# EAGLE design GPIO Split Protector with Console (EAGLE 7.4.0)
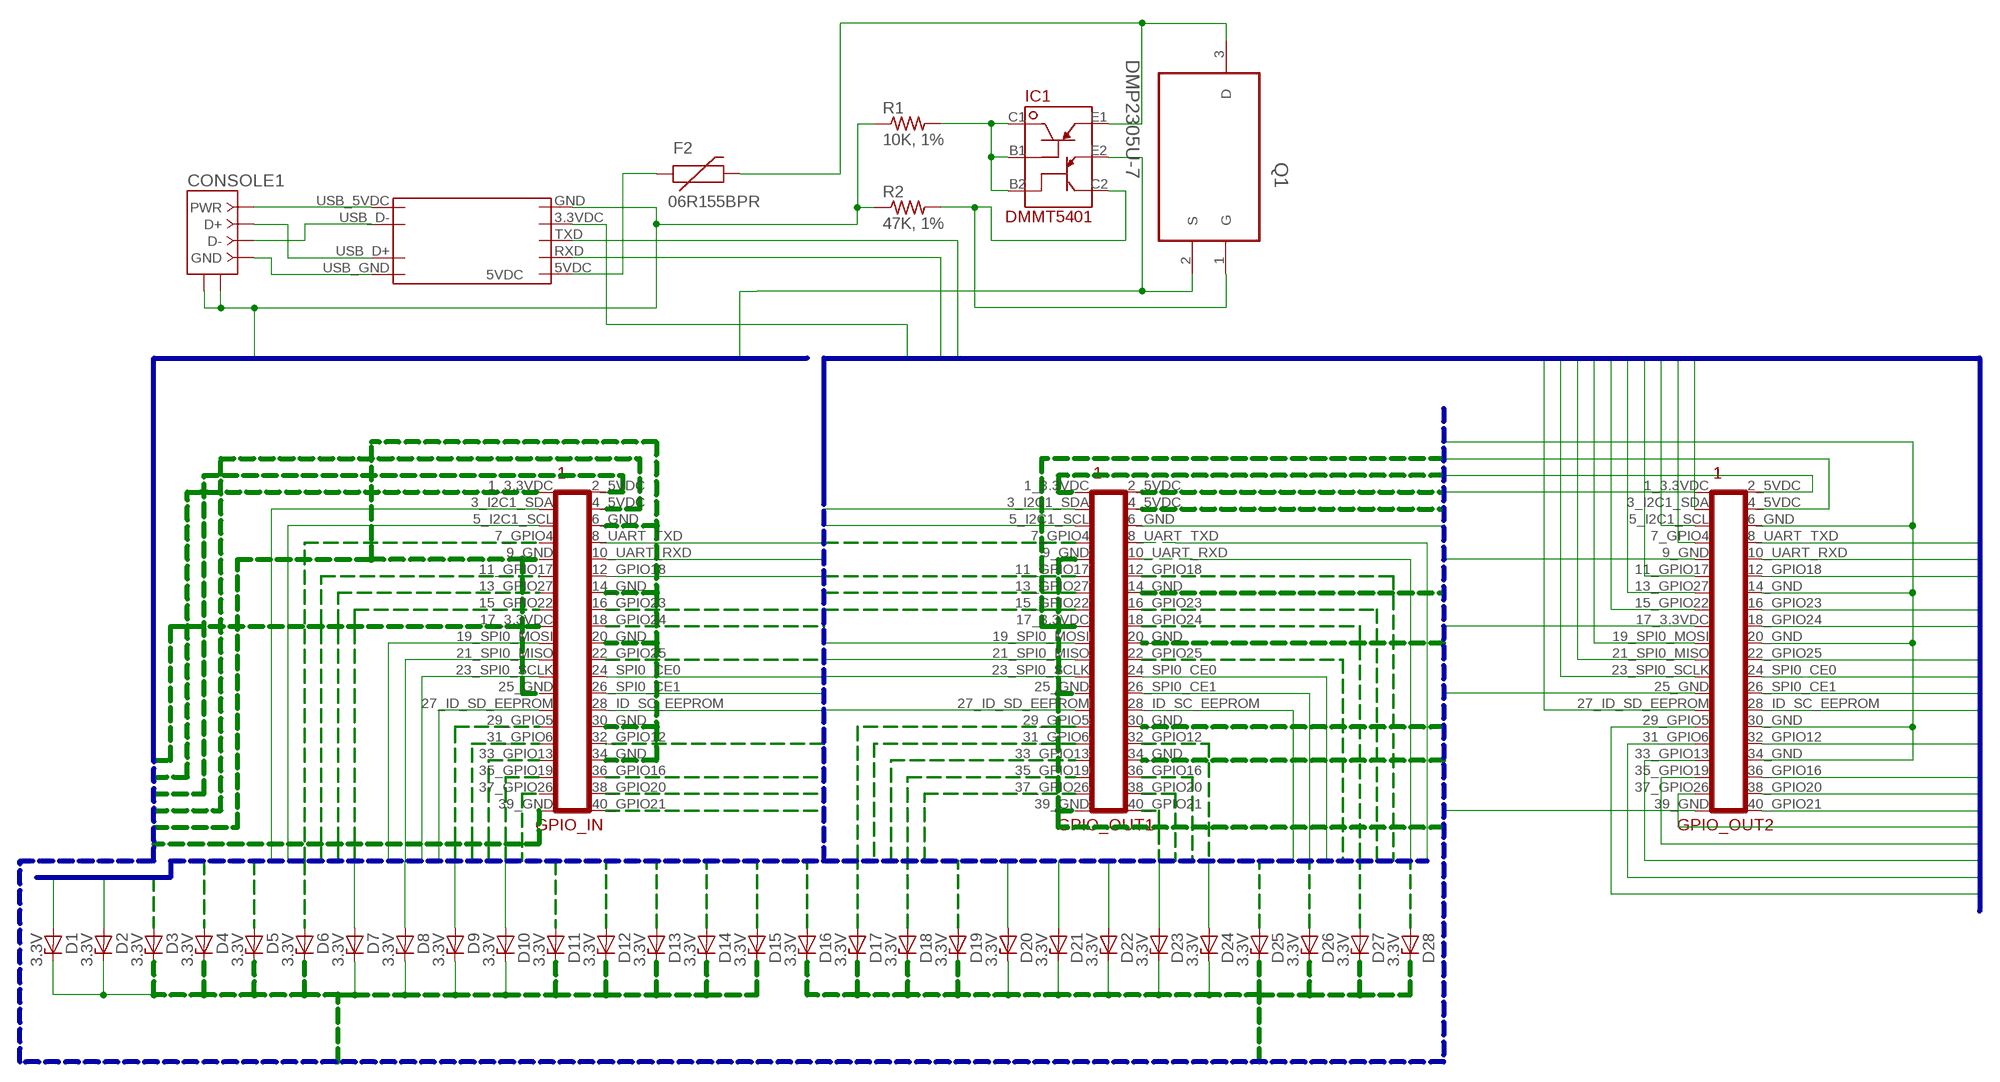
[diagram p0: schematic, sheet 1]

## Parts
CONSOLE1  USB-RA  [USBBF-1]
D1  3.3V  ZENER-DIODEDO41Z10  [DO41Z10]
D2  3.3V  ZENER-DIODEDO41Z10  [DO41Z10]
D3  3.3V  ZENER-DIODEDO41Z10  [DO41Z10]
D4  3.3V  ZENER-DIODEDO41Z10  [DO41Z10]
D5  3.3V  ZENER-DIODEDO41Z10  [DO41Z10]
D6  3.3V  ZENER-DIODEDO41Z10  [DO41Z10]
D7  3.3V  ZENER-DIODEDO41Z10  [DO41Z10]
D8  3.3V  ZENER-DIODEDO41Z10  [DO41Z10]
D9  3.3V  ZENER-DIODEDO41Z10  [DO41Z10]
D10  3.3V  ZENER-DIODEDO41Z10  [DO41Z10]
D11  3.3V  ZENER-DIODEDO41Z10  [DO41Z10]
D12  3.3V  ZENER-DIODEDO41Z10  [DO41Z10]
D13  3.3V  ZENER-DIODEDO41Z10  [DO41Z10]
D14  3.3V  ZENER-DIODEDO41Z10  [DO41Z10]
D15  3.3V  ZENER-DIODEDO41Z10  [DO41Z10]
D16  3.3V  ZENER-DIODEDO41Z10  [DO41Z10]
D17  3.3V  ZENER-DIODEDO41Z10  [DO41Z10]
D18  3.3V  ZENER-DIODEDO41Z10  [DO41Z10]
D19  3.3V  ZENER-DIODEDO41Z10  [DO41Z10]
D20  3.3V  ZENER-DIODEDO41Z10  [DO41Z10]
D21  3.3V  ZENER-DIODEDO41Z10  [DO41Z10]
D22  3.3V  ZENER-DIODEDO41Z10  [DO41Z10]
D23  3.3V  ZENER-DIODEDO41Z10  [DO41Z10]
D24  3.3V  ZENER-DIODEDO41Z10  [DO41Z10]
D25  3.3V  ZENER-DIODEDO41Z10  [DO41Z10]
D26  3.3V  ZENER-DIODEDO41Z10  [DO41Z10]
D27  3.3V  ZENER-DIODEDO41Z10  [DO41Z10]
D28  3.3V  ZENER-DIODEDO41Z10  [DO41Z10]
F2  06R155BPR  PTCPTH  [PTC]
GPIO_IN  RPI_GPIOUPPER  [RPI_GPIO_MALE]
GPIO_OUT1  RPI_GPIOUPPER  [RPI_GPIO_MALE]
GPIO_OUT2  RPI_GPIOUPPER  [RPI_GPIO_MALE]
IC1  DMMT5401  DMMT5401DMMT  [DMMT5401]
Q1  DMP2305U-7  [SOT103P240X110-3N]
R1  10K, 1%  R-US_0204/7  [0204/7]
R2  47K, 1%  R-US_0204/7  [0204/7]
UART1  GS27159  [GS27159]

## Nets
3.3VDC1: GPIO_IN.1_3.3VDC GPIO_OUT1.1_3.3VDC GPIO_OUT2.1_3.3VDC
3.3VDC2: GPIO_IN.17_3.3VDC GPIO_OUT1.17_3.3VDC GPIO_OUT2.17_3.3VDC
5VDC1: GPIO_IN.2_5VDC GPIO_OUT1.2_5VDC GPIO_OUT2.2_5VDC
5VDC2: GPIO_IN.4_5VDC GPIO_OUT1.4_5VDC GPIO_OUT2.4_5VDC IC1.E2 Q1.2(S)
5VDC_TO_FUSE: F2.P$1 UART1.5VDC
GND: CONSOLE1.CASE1(SHIELD1) CONSOLE1.CASE2(SHIELD2) D1.C D2.C D3.C D4.C D5.C D6.C D7.C D8.C D9.C D10.C D11.C D12.C D13.C D14.C D15.C D16.C D17.C D18.C D19.C D20.C D21.C D22.C D23.C D24.C D25.C D26.C D27.C D28.C GPIO_IN.6_GND GPIO_IN.9_GND GPIO_IN.14_GND GPIO_IN.20_GND GPIO_IN.25_GND GPIO_IN.30_GND GPIO_IN.34_GND GPIO_IN.39_GND GPIO_OUT1.6_GND GPIO_OUT1.9_GND GPIO_OUT1.14_GND GPIO_OUT1.20_GND GPIO_OUT1.25_GND GPIO_OUT1.30_GND GPIO_OUT1.34_GND GPIO_OUT1.39_GND GPIO_OUT2.6_GND GPIO_OUT2.9_GND GPIO_OUT2.14_GND GPIO_OUT2.20_GND GPIO_OUT2.25_GND GPIO_OUT2.30_GND GPIO_OUT2.34_GND GPIO_OUT2.39_GND R1.1 R2.1 UART1.GND
GPIO4: D3.A GPIO_IN.7_GPIO4 GPIO_OUT1.7_GPIO4 GPIO_OUT2.7_GPIO4
GPIO5: D11.A GPIO_IN.29_GPIO5 GPIO_OUT1.29_GPIO5 GPIO_OUT2.29_GPIO5
GPIO6: D12.A GPIO_IN.31_GPIO6 GPIO_OUT1.31_GPIO6 GPIO_OUT2.31_GPIO6
GPIO12: D25.A GPIO_IN.32_GPIO12 GPIO_OUT1.32_GPIO12 GPIO_OUT2.32_GPIO12
GPIO13: D13.A GPIO_IN.33_GPIO13 GPIO_OUT1.33_GPIO13 GPIO_OUT2.33_GPIO13
GPIO16: D26.A GPIO_IN.36_GPIO16 GPIO_OUT1.36_GPIO16 GPIO_OUT2.36_GPIO16 UART1.3.3VDC
GPIO17: D4.A GPIO_IN.11_GPIO17 GPIO_OUT1.11_GPIO17 GPIO_OUT2.11_GPIO17
GPIO18: D16.A GPIO_IN.12_GPIO18 GPIO_OUT1.12_GPIO18 GPIO_OUT2.12_GPIO18
GPIO19: D14.A GPIO_IN.35_GPIO19 GPIO_OUT1.35_GPIO19 GPIO_OUT2.35_GPIO19
GPIO20: D27.A GPIO_IN.38_GPIO20 GPIO_OUT1.38_GPIO20 GPIO_OUT2.38_GPIO20
GPIO21: D28.A GPIO_IN.40_GPIO21 GPIO_OUT1.40_GPIO21 GPIO_OUT2.40_GPIO21
GPIO22: D6.A GPIO_IN.15_GPIO22 GPIO_OUT1.15_GPIO22 GPIO_OUT2.15_GPIO22
GPIO23: D17.A GPIO_IN.16_GPIO23 GPIO_OUT1.16_GPIO23 GPIO_OUT2.16_GPIO23
GPIO24: D18.A GPIO_IN.18_GPIO24 GPIO_OUT1.18_GPIO24 GPIO_OUT2.18_GPIO24
GPIO25: D19.A GPIO_IN.22_GPIO25 GPIO_OUT1.22_GPIO25 GPIO_OUT2.22_GPIO25
GPIO26: D15.A GPIO_IN.37_GPIO26 GPIO_OUT1.37_GPIO26 GPIO_OUT2.37_GPIO26
GPIO27: D5.A GPIO_IN.13_GPIO27 GPIO_OUT1.13_GPIO27 GPIO_OUT2.13_GPIO27
I2C_SCL: D2.A GPIO_IN.5_I2C1_SCL GPIO_OUT1.5_I2C1_SCL GPIO_OUT2.5_I2C1_SCL
I2C_SDA: D1.A GPIO_IN.3_I2C1_SDA GPIO_OUT1.3_I2C1_SDA GPIO_OUT2.3_I2C1_SDA
ID_SC: D24.A GPIO_IN.28_ID_SC_EEPROM GPIO_OUT1.28_ID_SC_EEPROM GPIO_OUT2.28_ID_SC_EEPROM
ID_SD: D10.A GPIO_IN.27_ID_SD_EEPROM(27_ID_SC_EEPROM) GPIO_OUT1.27_ID_SD_EEPROM(27_ID_SC_EEPROM) GPIO_OUT2.27_ID_SD_EEPROM(27_ID_SC_EEPROM)
IN: F2.P$2 IC1.E1 Q1.3(D)
N$2: IC1.B1 IC1.B2 IC1.C1 R1.2
N$3: IC1.C2 Q1.1(G) R2.2
N$14: CONSOLE1.4(GND) UART1.USB_GND
N$15: CONSOLE1.1(PWR) UART1.USB_5VDC
N$16: CONSOLE1.2(D-) UART1.USB_D-
N$17: CONSOLE1.3(D+) UART1.USB_D+
SPI_CE0: D22.A GPIO_IN.24_SPI0_CE0 GPIO_OUT1.24_SPI0_CE0 GPIO_OUT2.24_SPI0_CE0
SPI_CE1: D23.A GPIO_IN.26_SPI0_CE1 GPIO_OUT1.26_SPI0_CE1 GPIO_OUT2.26_SPI0_CE1
SPI_MISO: D8.A GPIO_IN.21_SPI0_MISO GPIO_OUT1.21_SPI0_MISO GPIO_OUT2.21_SPI0_MISO
SPI_MOSI: D7.A GPIO_IN.19_SPI0_MOSI GPIO_OUT1.19_SPI0_MOSI GPIO_OUT2.19_SPI0_MOSI
SPI_SCLK: D9.A GPIO_IN.23_SPI0_SCLK GPIO_OUT1.23_SPI0_SCLK GPIO_OUT2.23_SPI0_SCLK
UART_RXD: D21.A GPIO_IN.10_UART_RXD(10_UART0_RXD) GPIO_OUT1.10_UART_RXD(10_UART0_RXD) GPIO_OUT2.10_UART_RXD(10_UART0_RXD) UART1.RXD
UART_TXD: D20.A GPIO_IN.8_UART_TXD(8_UART0_TXD) GPIO_OUT1.8_UART_TXD(8_UART0_TXD) GPIO_OUT2.8_UART_TXD(8_UART0_TXD) UART1.TXD

## Buses
3.3VDC1,3.3VDC2,5VDC1,5VDC2,GND
GPIO4,GPIO5,GPIO6,GPIO12,GPIO13,GPIO14,GPIO16,GPIO17,GPIO18,GPIO19,GPIO20,GPIO21,GPIO22,GPIO23,GPIO24,GPIO25,GPIO26,GPIO27,ID_SC,ID_SD,I2C_SCL,I2C_SDA,SPI_CE0,SPI_CE1,SPI_MISO,SPI_MOSI,SPI_SCLK,UART_RXD,UART_TXD

## Library data of the parts
CONSOLE1 = connector:USB-R: USB connector, 2 shield pins; DESC: USB B socket; SUPPLIER: Jameco: 230958; VALSTAT: label
D1-D28 = diode:ZENER-DIODE: Z-Diode
F2 = SparkFun-PowerIC:PTC: Resettable Fuse PTC Resettable Fuse. Spark Fun Electronics SKU : COM-08357
GPIO_IN GPIO_OUT1 GPIO_OUT2 = connectors:RPI_GPIO*: GPIO Connector for Raspberry Pi.
IC1 = Diodes_Inc_By_element14_Batch_1:DMMT5401
Q1 = Diodes_Inc_By_element14_Batch_1:DMP2305U-7: P-CHANNEL ENHANCEMENT MODE MOSFET; MPN: DMP2305U-7; OC_FARNELL: 1858668; OC_NEWARK: 23T5607; PACKAGE: SOT-23-3; SUPPLIER: DIODES INC.
R1 R2 = resistor:R-US_: RESISTOR, American symbol
UART1 = packages:GS27159: From JBTek USB to Console Cable Board: TTD-C GS27159

## Board
GPIO Protect & Split Splits the GPIO connection into two connectors, while adding protection to IO circuits so they can only take 3.3VDC and no more. All extra power gets grounded. Mounting The assembly is made to mount underneat the RPi, with the single GPIO connector hanging out. Tall enough standoffs should be used to allow connection to both connectors underneath it.
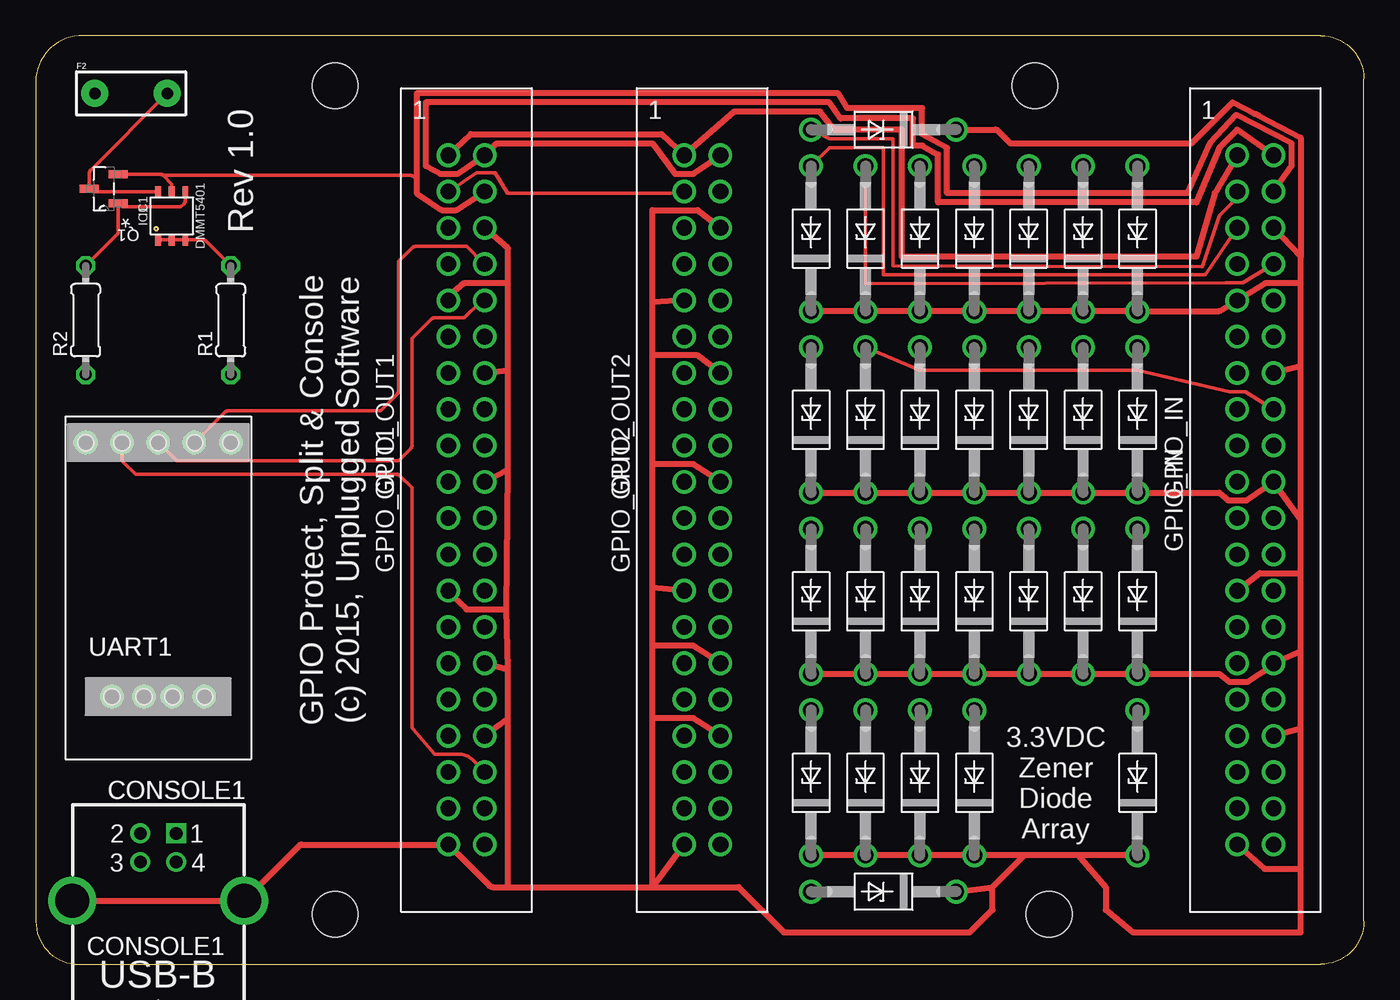
[diagram p1: board, top side]
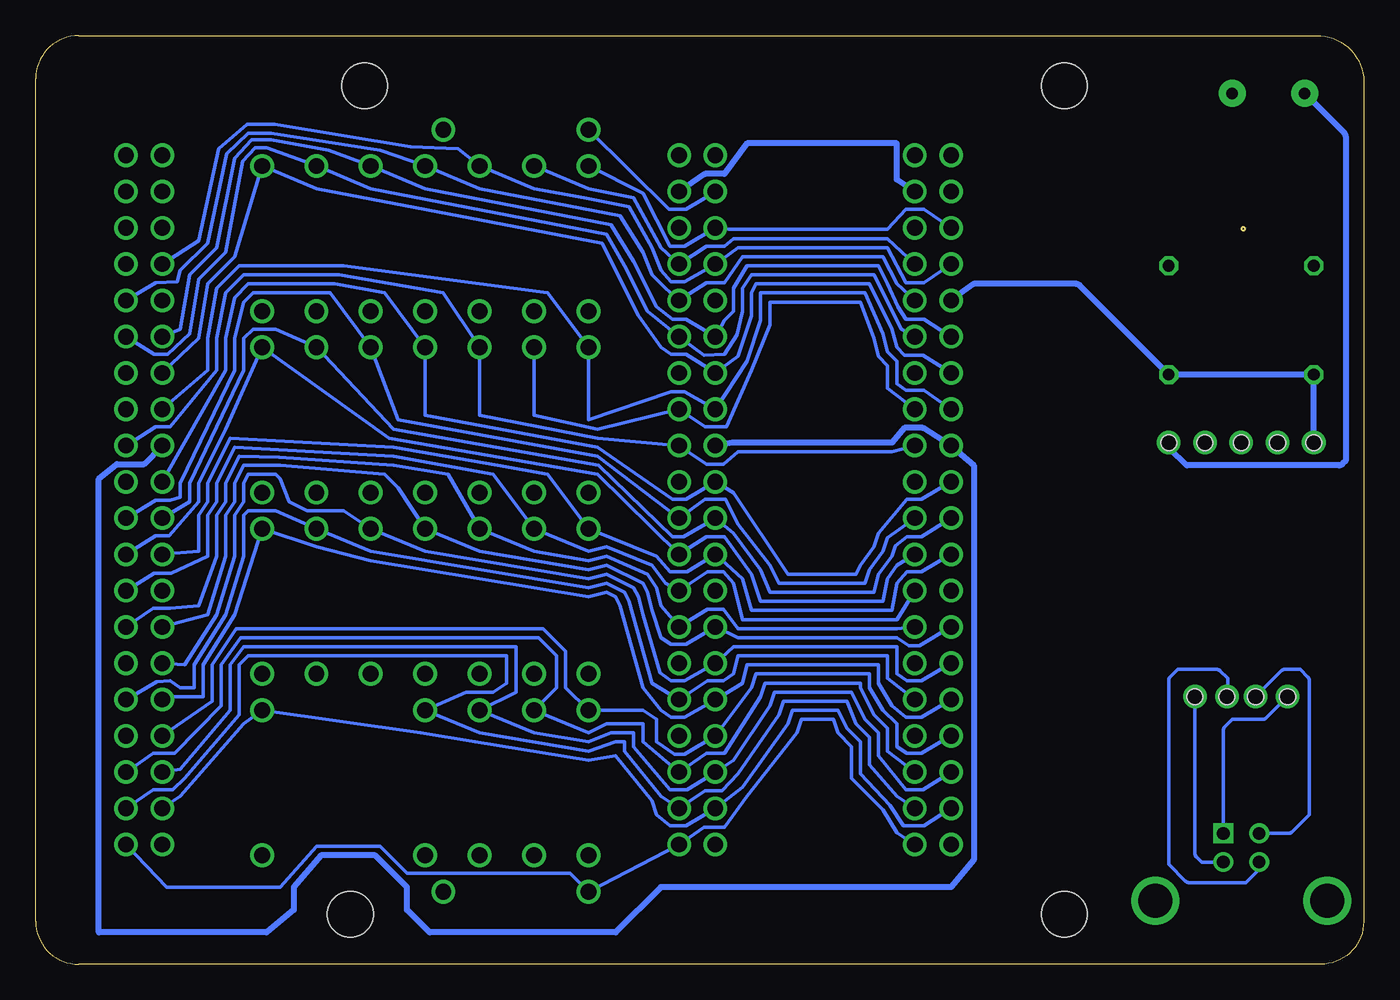
[diagram p2: board, bottom side, seen from below]

Size 93.01 x 65 mm. Coordinates in mm from the lower left corner, seen from the top.
Outline: 3.01,0 90.01,0 arc90 93.01,3 93.01,62 arc90 90.01,65 3.01,65 arc90 0.01,61.5 0.01,3 arc90 3.01,0
Copper layers (1*16): Top 0.035mm / dielectric 1.5mm / Bottom 0.035mm
Design rules "default *": minimum track width 10mil, minimum drill 24mil, track to track 8mil, track to pad 8mil, pad to pad 8mil, via to via 8mil, smd to smd 8mil, copper to edge 40mil, drill to drill 8mil, minimum pad ring 10mil, minimum via ring 8mil, stop-mask expansion 4mil, vias tented up to drill 0mil, thermal gap 10mil
Holes 3.2 mm at 20.97,3.5 70.97,3.5 69.97,61.5 20.97,61.5

### Footprints (pad centres in the part's own frame; a part is rotated, then mirrored left to right if it is on the bottom)
USBBF-1 = drill 0.889 pad 1.321 square: 1 -1.25,-4.71 | drill 0.889 pad 1.321: 2 1.25,-4.71; 3 1.25,-2.71; 4 -1.25,-2.71 | drill 2.362 pad 3.175: CASE1 -6.02,0; CASE2 6.02,0
DO41Z10 = drill 1.118: A 5.08,0; C -5.08,0
PTC = drill 0.8 pad 1.88: P$1 -2.54,0; P$2 2.54,0
RPI_GPIO_MALE = drill 1.1: 1_3.3VDC -1.27,24.13; 2_5VDC 1.27,24.13; 3_I2C1_SDA -1.27,21.59; 4_5VDC 1.27,21.59; 5_I2C1_SCL -1.27,19.05; 6_GND 1.27,19.05; 7_GPIO4 -1.27,16.51; 8_UART_TXD 1.27,16.51; 9_GND -1.27,13.97; 10_UART_RXD 1.27,13.97; 11_GPIO17 -1.27,11.43; 12_GPIO18 1.27,11.43; 13_GPIO27 -1.27,8.89; 14_GND 1.27,8.89; 15_GPIO22 -1.27,6.35; 16_GPIO23 1.27,6.35; 17_3.3VDC -1.27,3.81; 18_GPIO24 1.27,3.81; 19_SPI0_MOSI -1.27,1.27; 20_GND 1.27,1.27; 21_SPI0_MISO -1.27,-1.27; 22_GPIO25 1.27,-1.27; 23_SPI0_SCLK -1.27,-3.81; 24_SPI0_CE0 1.27,-3.81; 25_GND -1.27,-6.35; 26_SPI0_CE1 1.27,-6.35; 27_ID_SD_EEPROM -1.27,-8.89; 28_ID_SC_EEPROM 1.27,-8.89; 29_GPIO5 -1.27,-11.43; 30_GND 1.27,-11.43; 31_GPIO6 -1.27,-13.97; 32_GPIO12 1.27,-13.97; 33_GPIO13 -1.27,-16.51; 34_GND 1.27,-16.51; 35_GPIO19 -1.27,-19.05; 36_GPIO16 1.27,-19.05; 37_GPIO26 -1.27,-21.59; 38_GPIO20 1.27,-21.59; 39_GND -1.27,-24.13; 40_GPIO21 1.27,-24.13
DMMT5401 = smd 0.406 x 0.813: B1 0,-1.676; B2 0.95,-1.676; C1 -0.95,-1.676; C2 0.95,1.676; E1 -0.95,1.676; E2 0,1.676
SOT103P240X110-3N = smd 1.321 x 0.559: 1 -1.016,1.016; 2 -1.016,-1.016; 3 1.016,0
0204/7 = drill 0.813 octagon: 1 -3.81,0; 2 3.81,0
GS27159 = drill 1.1: 3.3VDC -2.54,10.16; 5VDC 5.08,10.16; GND -5.08,10.16; RXD 0,10.16; TXD 2.54,10.16; USB_5VDC -3.24,-7.62; USB_D+ 1,-7.62; USB_D- -1,-7.62; USB_GND 3.24,-7.62 | hole 1.1: 1,-7.62; 3.24,-7.62; -1,-7.62; -3.24,-7.62; -5.08,10.16; -2.54,10.16; 0,10.16; 2.54,10.16; 5.08,10.16

### Placement (x,y rotation side)
CONSOLE1  8.58,4.45 180 top
D1  59.38,58.42 180 top
D2  54.3,50.8 90 top
D3  61.92,50.8 90 top
D4  69.54,50.8 90 top
D5  77.16,50.8 90 top
D6  54.3,38.1 90 top
D7  65.73,38.1 90 top
D8  73.35,38.1 90 top
D9  54.3,25.4 90 top
D10  65.73,25.4 90 top
D11  69.54,25.4 90 top
D12  77.16,25.4 90 top
D13  54.3,12.7 90 top
D14  61.92,12.7 90 top
D15  77.16,12.7 90 top
D16  73.35,50.8 90 top
D17  58.11,38.1 90 top
D18  61.92,38.1 90 top
D19  69.54,38.1 90 top
D20  58.11,50.8 90 top
D21  65.73,50.8 90 top
D22  77.16,38.1 90 top
D23  58.11,25.4 90 top
D24  61.92,25.4 90 top
D25  73.35,25.4 90 top
D26  58.11,12.7 90 top
D27  65.73,12.7 90 top
D28  59.38,5.08 180 top
F2  6.68,60.96 0 top
GPIO_IN  85.42,32.5 0 top
GPIO_OUT1  30.17,32.5 0 top
GPIO_OUT2  46.68,32.5 0 top
IC1  9.53,52.39 0 top
Q1  4.77,54.29 180 top
R1  13.66,45.09 90 top
R2  3.5,45.09 90 top
UART1  8.58,26.35 0 top

### Tracks (layer width: path | path; a pad name or v marks a point on that pad's centre or on a via)
3.3VDC1
  Top 0.406: GPIO_OUT1.1_3.3VDC 30.49,58.1 43.82,58.1 GPIO_OUT2.1_3.3VDC 48.9,59.69 54.94,59.69 55.89,58.42 60.65,58.42 60.65,49.53 81.29,49.53 82.56,53.98 GPIO_IN.1_3.3VDC
3.3VDC2
  Bottom 0.406: GPIO_OUT2.17_3.3VDC 44.22,36.51 33.03,36.51 32.16,37.54 30.89,37.54 GPIO_OUT1.17_3.3VDC 27.31,34.92 27.31,7.3 28.9,5.4 49.22,5.4 52.4,2.22 65.41,2.22 67,3.81 67,5.4 69.22,7.62 73.03,7.62 74.94,5.4 74.94,3.81 76.84,2.22 88.59,2.22 88.59,33.97 87.32,35 85.42,35 GPIO_IN.17_3.3VDC
5VDC1
  Top 0.406: GPIO_OUT2.2_5VDC 46.05,55.32 44.78,55.32 43.19,57.47 32.28,57.47 GPIO_OUT1.2_5VDC 29.54,55.32 28.35,55.32 27.31,55.88 27.31,60.33 55.57,60.33 56.37,59.21 61.45,59.21 61.45,57.31 62.11,57.31 63.19,56.67 63.19,53.34 81.29,53.34 82.88,57.15 84.15,58.42 GPIO_IN.2_5VDC
5VDC2
  Top 0.254: Q1.2 8.7,55.31 arc-45 8.93,55.22 | 8.93,55.22 9.53,54.61 IC1.E2 | 8.93,55.22 26.26,55.22 arc-45 26.48,55.12 26.68,54.93
  Top 0.406: GPIO_IN.4_5VDC 87.96,55.88 87.96,57.47 84.07,59.45 82.24,57.47 80.65,53.98 63.83,53.98 63.83,57.15 62.08,58.1 62.08,59.93 56.84,59.93 56.21,60.96 26.68,60.96 26.68,54.93 26.68,53.98 28.43,52.78 29.46,52.78 GPIO_OUT1.4_5VDC
  Bottom 0.406: GPIO_OUT1.4_5VDC 32.71,54.93 32.71,57.47 43.19,57.47 44.78,55.32 46.13,55.32 GPIO_OUT2.4_5VDC
5VDC_TO_FUSE
  Bottom 0.406: F2.P$1 1.37,58.2 arc45 1.28,57.97 1.28,35.24 1.5,35.02 arc45 1.73,34.92 12.39,34.92 13.57,36.1 arc45 13.66,36.33 UART1.5VDC
GND
  Top 0.406: GPIO_OUT1.6_GND 33.03,50.16 33.03,47.7 | 33.03,47.7 33.03,41.59 | 33.03,41.59 33.03,34.61 | 33.03,34.61 32.95,24.84 | 32.95,24.84 33.03,20.64 | 33.03,20.64 33.03,17.14 | 33.03,5.4 32.01,5.4 arc-45 31.78,5.49 GPIO_OUT1.39_GND 18.66,8.37 arc45 18.43,8.28 CONSOLE1.CASE1 CONSOLE1.CASE2 | 33.03,5.4 43.19,5.4 | 43.19,5.4 GPIO_OUT2.39_GND | 43.19,5.4 43.19,17.22 | 43.19,17.22 43.19,22.3 | 43.19,22.3 43.19,26.35 | 43.19,26.35 43.19,35 | 43.19,35 43.19,42.62 | 43.19,42.62 43.19,46.35 | 43.19,46.35 43.19,52.78 46.36,52.78 GPIO_OUT2.6_GND | 43.19,5.4 49.22,5.4 52.4,2.22 65.41,2.22 67,3.81 67,5.4 | 88.59,6.67 88.59,2.22 76.84,2.22 74.94,3.81 74.94,5.4 73.03,7.62 | 88.59,6.67 88.59,16.51 | 88.59,16.51 88.59,21.91 | 88.59,21.91 88.59,27.38 | 88.59,27.38 88.59,31.11 | 88.59,31.11 88.59,41.91 | 88.59,41.91 88.59,47.7 | 88.59,47.7 88.59,49.53 | 88.59,49.53 GPIO_IN.6_GND | 88.59,47.7 86.13,47.7 GPIO_IN.9_GND 82.88,45.72 D5.C D16.C D4.C D21.C D3.C D20.C D2.C | 88.59,31.11 GPIO_IN.20_GND 84.78,32.46 83.51,32.46 82.88,33.02 D22.C D8.C D19.C D7.C D18.C D17.C D6.C | GPIO_IN.25_GND 85.73,27.38 88.59,27.38 | GPIO_IN.30_GND 87.18,21.29 | 87.18,21.29 88.59,21.91 | GPIO_IN.34_GND 88.59,16.51 | GPIO_IN.39_GND 86.05,6.67 88.59,6.67 | GPIO_IN.14_GND 88.59,41.91 | 33.03,17.14 GPIO_OUT1.34_GND | GPIO_OUT1.30_GND 33.03,20.64 | GPIO_OUT1.25_GND arc45 28.98,25.95 30.17,24.84 32.95,24.84 | GPIO_OUT1.20_GND 33.03,34.61 | GPIO_OUT1.14_GND 33.03,41.59 | GPIO_OUT1.9_GND 28.9,46.62 arc-45 28.99,46.84 30.01,47.7 33.03,47.7 | GPIO_OUT2.9_GND 43.19,46.35 | GPIO_OUT2.14_GND 46.36,42.62 43.19,42.62 | GPIO_OUT2.20_GND 46.05,35 43.19,35 | GPIO_OUT2.25_GND 43.19,26.35
  Top 0.406: GPIO_OUT2.30_GND 46.05,22.3 43.19,22.3 | GPIO_OUT2.34_GND 46.05,17.22 43.19,17.22 | 87.18,21.29 84.86,19.76 83.59,19.76 82.88,20.32 D12.C D25.C D11.C D10.C D24.C D23.C D9.C | D15.C 73.03,7.62 | 73.03,7.62 69.22,7.62 | 69.22,7.62 D27.C D14.C D26.C D13.C | 67,5.4 69.22,7.62 | D28.C 67,5.4 | 33.03,17.14 33.03,5.4 | D1.C 67.19,58.42 arc-45 67.41,58.33 68.27,57.47 80.84,57.47 arc45 81.06,57.56 83.83,60.33 85.36,59.53 arc-45 85.59,59.44 88.59,57.86 88.59,49.53
  Bottom 0.406: GPIO_OUT1.9_GND 27.31,47.62 20.14,47.62 arc45 19.92,47.53 R1.1 R2.1 UART1.GND
GPIO4
  Bottom 0.254: GPIO_OUT1.7_GPIO4 30.81,47.7 32.08,47.7 33.35,50.16 43.82,50.16 GPIO_OUT2.7_GPIO4 47.56,47.78 48.51,47.78 49.22,48.58 49.86,50.16 51.44,53.02 54.62,53.66 58.11,54.29 D3.A 63.43,57.07 66.76,57.23 76.29,58.82 78.19,58.82 80.18,57.07 81.61,50.64 GPIO_IN.7_GPIO4
GPIO5
  Bottom 0.254: GPIO_OUT1.29_GPIO5 30.97,19.84 32,19.84 32.71,20.32 32.71,22.23 44.14,22.23 GPIO_OUT2.29_GPIO5 47.56,19.84 48.51,19.84 49.3,20.4 50.49,24.45 50.81,25.72 51.13,26.35 53.03,27.3 54.3,26.99 65.73,28.89 D11.A 71.45,31.75 73.99,31.75 75.26,32.38 75.89,33.97 76.21,34.29 78.11,34.29 78.43,33.66 78.43,32.38 79.07,31.43 79.07,28.57 80.34,24.45 82.56,20.95 GPIO_IN.29_GPIO5
GPIO6
  Bottom 0.254: GPIO_OUT1.31_GPIO6 30.97,17.3 32.08,17.3 33.03,18.1 33.98,19.68 33.98,20.95 43.19,20.95 43.51,19.68 GPIO_OUT2.31_GPIO6 47.56,17.3 48.51,17.3 49.22,17.78 50.49,19.37 52.08,25.08 52.4,25.72 53.03,26.04 54.3,25.72 69.54,28.26 73.35,29.21 D12.A 79.07,24.45 81.29,20.95 81.29,18.73 83.94,18.73 GPIO_IN.31_GPIO6
GPIO12
  Bottom 0.254: GPIO_OUT1.32_GPIO12 33.35,20 33.35,21.59 43.82,21.59 44.14,20.32 44.86,19.84 45.97,19.84 GPIO_OUT2.32_GPIO12 49.86,19.68 51.44,25.4 51.76,26.04 53.03,26.67 54.3,26.35 69.54,28.89 D25.A 76.21,31.75 78.11,31.75 78.43,31.43 78.43,28.57 79.7,24.45 81.92,20.95 81.92,19.37 82.88,19.37 83.59,19.84 84.54,19.76 GPIO_IN.32_GPIO12
GPIO13
  Bottom 0.254: GPIO_OUT1.33_GPIO13 30.97,14.76 32,14.76 32.71,15.24 32.71,16.83 33.66,17.78 34.62,19.37 34.62,20.32 42.55,20.32 42.87,19.37 GPIO_OUT2.33_GPIO13 47.56,14.68 48.27,14.68 49.54,15.56 49.54,17.14 50.49,17.78 D13.A 55.89,19.37 55.89,21.91 57.48,23.5 78.99,23.5 80.65,20.95 80.65,18.41 GPIO_IN.33_GPIO13
GPIO16
  Top 0.254: UART1.3.3VDC 6.04,35.37 arc45 6.13,35.15 6.99,34.29 25.28,34.29 arc-45 25.5,34.2 26.36,33.34 26.36,16.64 arc45 26.45,16.42 27.95,14.68 29.84,14.68 arc-45 30.7,14.2 GPIO_OUT1.36_GPIO16
  Bottom 0.254: GPIO_OUT1.36_GPIO16 33.35,14.92 33.35,16.51 34.3,17.46 35.25,19.37 35.25,19.68 41.92,19.68 42.24,18.73 44.78,14.76 46.05,14.76 GPIO_OUT2.36_GPIO16 50.49,15.56 50.49,16.83 53.03,16.83 54.3,16.19 D26.A 56.52,19.37 56.52,21.59 57.79,22.86 78.67,22.86 80.02,20.95 80.02,18.1 83.27,14.76 84.78,14.76 GPIO_IN.36_GPIO16
GPIO17
  Bottom 0.254: GPIO_OUT1.11_GPIO17 30.81,45.16 32.08,45.16 32.63,46.04 33.35,47.62 33.98,48.9 43.19,48.9 44.14,47.31 44.14,45.72 44.78,45.09 GPIO_OUT2.11_GPIO17 47.48,45.16 48.43,45.16 49.54,46.04 51.13,49.21 52.71,51.75 65.73,54.29 D4.A 72.48,56.99 76.53,57.71 77.88,57.71 79.07,56.44 80.34,50.16 82.24,48.26 82.88,44.45 GPIO_IN.11_GPIO17
GPIO18
  Bottom 0.254: GPIO_OUT1.12_GPIO18 32.39,44.45 34.3,48.26 42.87,48.26 43.51,47.31 43.51,45.72 43.9,44.05 44.78,42.7 46.21,42.62 GPIO_OUT2.12_GPIO18 50.17,45.72 51.76,48.9 53.03,51.12 69.54,54.29 D16.A 76.84,57.15 77.64,57.15 78.51,56.2 79.7,49.85 81.61,47.94 82.24,44.13 83.75,42.7 84.7,42.7 GPIO_IN.12_GPIO18
GPIO19
  Bottom 0.254: GPIO_OUT1.35_GPIO19 30.89,12.22 32.08,12.22 33.98,14.61 33.98,16.19 34.93,17.14 35.89,19.05 41.28,19.05 41.6,18.1 44.14,14.29 GPIO_OUT2.35_GPIO19 47.4,12.22 48.59,12.22 51.13,15.24 51.13,16.19 52.71,16.19 54.3,15.56 58.11,16.19 D14.A 59.38,19.05 59.38,22.23 78.43,22.23 79.38,20.95 79.38,17.78 82.88,13.65 GPIO_IN.35_GPIO19
GPIO20
  Bottom 0.254: GPIO_OUT1.38_GPIO20 32.71,11.75 34.62,13.97 34.62,15.88 35.57,16.83 36.2,18.41 40.65,18.41 40.97,17.46 43.82,13.34 44.94,12.14 46.13,12.14 GPIO_OUT2.38_GPIO20 49.22,11.75 51.76,14.92 51.76,15.56 52.4,15.56 54.3,14.92 61.92,16.19 D27.A 62.87,19.05 60.97,19.05 60.02,19.68 60.02,21.59 78.11,21.59 78.75,20.95 78.75,17.46 82.56,13.02 83.43,12.22 84.78,12.22 GPIO_IN.38_GPIO20
GPIO21
  Bottom 0.254: GPIO_OUT1.40_GPIO21 32.71,9.21 33.66,10.79 35.89,13.02 35.89,15.24 36.84,16.19 37.16,17.14 39.38,17.14 39.7,16.19 43.19,11.75 44.78,9.6 46.21,9.6 GPIO_OUT2.40_GPIO21 D28.A 55.57,6.35 67,6.35 68.91,8.26 73.35,8.26 75.89,5.4 83.83,5.4 GPIO_IN.40_GPIO21
GPIO22
  Bottom 0.254: GPIO_OUT1.15_GPIO22 30.81,40.16 32.08,40.16 32.71,40.64 32.71,42.23 33.35,42.86 33.66,44.13 34.93,46.99 42.24,46.99 42.24,45.09 43.19,42.23 GPIO_OUT2.15_GPIO22 47.56,40.08 48.51,40.08 54.3,38.1 D6.A 57.16,46.99 71.45,48.9 78.75,48.9 80.34,47.31 80.97,43.81 80.97,41.59 GPIO_IN.15_GPIO22
GPIO23
  Top 0.254: GPIO_IN.16_GPIO23 84.7,40.08 83.59,40.08 77.16,41.59 61.92,41.59 D17.A
  Bottom 0.254: GPIO_OUT1.16_GPIO23 33.35,40.32 33.35,41.91 33.98,42.55 34.3,43.81 35.25,46.35 41.6,46.35 41.6,44.77 42.87,41.59 44.62,37.62 46.13,37.62 GPIO_OUT2.16_GPIO23 53.67,37.47 58.11,38.42 D17.A
GPIO24
  Bottom 0.254: GPIO_OUT1.18_GPIO24 33.03,35.88 43.82,35.88 44.86,35 46.05,35 GPIO_OUT2.18_GPIO24 53.67,36.83 61.92,38.42 D18.A 64.46,46.99 71.76,48.26 78.43,48.26 79.7,46.99 80.34,43.81 80.34,41.59 83.59,37.62 84.62,37.62 GPIO_IN.18_GPIO24
GPIO25
  Bottom 0.254: GPIO_OUT1.22_GPIO25 33.35,29.84 33.66,28.89 34.62,27.62 34.93,26.67 40.97,26.67 41.6,27.94 43.82,30.8 44.7,32.54 46.13,32.54 GPIO_OUT2.22_GPIO25 53.67,35.56 67.64,38.1 D19.A 72.4,46.99 77.8,46.99 78.43,46.35 79.07,43.81 79.07,41.59 82.88,33.66 82.88,32.7 83.59,32.46 84.62,32.46 GPIO_IN.22_GPIO25
GPIO26
  Bottom 0.254: GPIO_OUT1.37_GPIO26 30.81,9.68 32.24,9.68 33.19,11.11 35.25,13.34 35.25,15.56 36.2,16.51 36.84,17.78 40.01,17.78 40.33,16.83 43.51,12.38 GPIO_OUT2.37_GPIO26 47.48,9.68 48.59,9.68 49.54,10.48 49.86,11.43 52.4,14.61 54.3,14.29 62.24,15.56 66.05,16.19 D15.A 78.43,16.83 82.88,11.75 GPIO_IN.37_GPIO26
GPIO27
  Bottom 0.254: GPIO_OUT1.13_GPIO27 30.89,42.62 32.16,42.62 32.71,43.18 33.03,44.45 34.62,47.62 42.55,47.62 42.87,46.99 42.87,45.4 43.82,42.55 GPIO_OUT2.13_GPIO27 47.48,42.7 48.51,42.7 49.22,43.18 50.81,45.4 53.35,50.48 73.35,54.29 D5.A 79.07,49.53 80.97,47.62 81.61,43.81 GPIO_IN.13_GPIO27
I2C_SCL
  Top 0.254: GPIO_IN.5_I2C1_SCL 81.92,48.26 59.38,48.26 59.38,57.15 55.57,57.15 D2.A
  Bottom 0.254: GPIO_OUT1.5_I2C1_SCL 30.81,52.86 32.08,52.86 33.35,51.44 44.46,51.44 GPIO_OUT2.5_I2C1_SCL 47.56,50.24 48.59,50.24 50.49,53.98 D2.A
I2C_SDA
  Top 0.254: GPIO_OUT1.3_I2C1_SDA 30.89,55.4 32.16,55.4 33.03,53.98 44.46,53.98 GPIO_OUT2.3_I2C1_SDA | D1.A 55.57,57.78 60.02,57.78 60.02,48.9 81.69,48.82 82.88,52.39 84.05,53.56 arc45 84.15,53.79 GPIO_IN.3_I2C1_SDA
  Bottom 0.254: GPIO_OUT2.3_I2C1_SDA 47.48,52.86 48.67,52.86 D1.A
ID_SC
  Bottom 0.254: GPIO_OUT1.28_ID_SC_EEPROM 32.71,23.5 43.82,23.5 44.86,24.84 45.97,24.84 GPIO_OUT2.28_ID_SC_EEPROM 49.22,25.08 49.54,26.35 50.17,27.3 53.03,28.57 54.3,28.26 58.11,28.89 D24.A 64.14,34.29 67.95,34.92 75.97,35.48 78.75,35.56 79.7,33.66 79.7,32.38 80.34,31.43 80.34,28.57 81.61,25.08 83.59,24.92 84.78,24.92 GPIO_IN.28_ID_SC_EEPROM
ID_SD
  Bottom 0.254: GPIO_OUT1.27_ID_SD_EEPROM 31.12,22.3 31.84,22.3 32.71,22.86 43.82,22.86 GPIO_OUT2.27_ID_SD_EEPROM 47.48,22.38 48.51,22.38 49.22,22.86 49.86,24.77 50.17,26.04 50.49,26.67 53.03,27.94 54.3,27.62 61.92,28.89 D10.A 67.64,33.34 68.59,34.29 75.89,34.92 78.43,34.92 79.07,33.66 79.07,32.38 79.7,31.43 79.7,28.57 80.97,24.45 GPIO_IN.27_ID_SD_EEPROM
IN
  Top 0.254: F2.P$2 3.85,55.59 arc45 3.76,55.37 Q1.3 3.89,54.16 arc45 4.12,54.06 IC1.E1
N$2
  Top 0.254: IC1.C1 IC1.B1 IC1.B2 11.71,50.71 arc-45 11.94,50.62 R1.2
N$3
  Top 0.254: R2.2 5.7,51.09 arc45 5.79,51.31 Q1.1 5.95,53.12 arc45 6.17,53.02 10.17,53.02 10.39,53.24 arc45 10.48,53.47 IC1.C2
N$14
  Bottom 0.254: UART1.USB_GND 11.82,7.74 arc-45 11.73,7.51 11.36,7.14 9.86,7.14 arc-45 CONSOLE1.4
N$15
  Bottom 0.254: CONSOLE1.1 9.83,16.4 arc45 9.74,16.62 9.22,17.14 7.06,17.14 arc-45 6.84,17.24 UART1.USB_5VDC
N$16
  Bottom 0.254: UART1.USB_D- 5.77,20.55 arc45 5.55,20.64 4.45,20.64 3.91,20.09 arc45 3.82,19.87 3.82,10.48 5.05,9.25 arc45 5.27,9.15 CONSOLE1.2
N$17
  Bottom 0.254: CONSOLE1.3 7.33,6.78 arc45 7.42,6.55 8.26,5.71 12.26,5.71 arc45 12.48,5.81 13.66,6.99 13.66,19.87 arc45 13.57,20.09 13.03,20.64 10.3,20.64 arc45 10.08,20.55 9.53,20 9.53,18.85 arc45 UART1.USB_D+
SPI_CE0
  Bottom 0.254: GPIO_OUT1.24_SPI0_CE0 32.71,27.94 33.35,26.99 33.66,25.4 42.24,25.4 42.87,27.3 44.78,29.92 46.05,29.92 GPIO_OUT2.24_SPI0_CE0 53.67,34.29 68.27,36.83 D22.A 79.7,37.47 81.61,33.66 81.61,32.38 83.67,30 84.62,30 GPIO_IN.24_SPI0_CE0
SPI_CE1
  Bottom 0.254: GPIO_OUT1.26_SPI0_CE1 32.71,24.13 43.51,24.13 44.14,26.67 44.86,27.46 45.97,27.46 GPIO_OUT2.26_SPI0_CE1 48.9,26.67 49.86,27.94 53.03,29.21 54.3,28.89 D23.A 60.97,34.29 67.95,35.56 79.07,36.2 80.34,33.66 80.34,32.38 80.97,31.43 80.97,28.57 83.51,27.38 84.7,27.38 GPIO_IN.26_SPI0_CE1
SPI_MISO
  Bottom 0.254: GPIO_OUT1.21_SPI0_MISO 30.97,29.92 32,29.92 32.79,29.29 33.03,28.57 33.98,27.3 34.3,26.04 41.6,26.04 42.24,27.62 44.14,30.16 GPIO_OUT2.21_SPI0_MISO 47.63,29.92 48.43,29.92 53.59,34.92 67.95,37.47 D8.A 76.21,44.45 77.8,44.45 78.43,43.81 78.43,41.59 82.24,33.66 82.24,32.38 GPIO_IN.21_SPI0_MISO
SPI_MOSI
  Bottom 0.254: GPIO_OUT1.19_SPI0_MOSI 30.97,32.54 32,32.54 33.98,30.16 34.3,29.21 35.25,27.94 35.57,27.3 40.33,27.3 44.14,33.02 GPIO_OUT2.19_SPI0_MOSI 47.48,32.54 48.43,32.54 53.67,36.2 65.73,38.42 D7.A 68.59,46.99 72.08,47.62 78.11,47.62 79.07,46.67 79.7,43.81 79.7,41.59 GPIO_IN.19_SPI0_MOSI
SPI_SCLK
  Bottom 0.254: GPIO_OUT1.23_SPI0_SCLK 30.97,27.46 32,27.46 32.71,26.67 33.03,24.77 42.87,24.77 43.51,26.99 GPIO_OUT2.23_SPI0_SCLK 47.4,27.46 48.59,27.46 49.54,28.57 D9.A 57.16,34.29 60.65,34.92 67.95,36.2 79.38,36.83 80.97,33.66 80.97,32.38 81.61,31.43 81.61,28.89 GPIO_IN.23_SPI0_SCLK
UART_RXD
  Top 0.254: UART1.RXD 9.76,35.34 arc45 9.98,35.24 25.41,35.24 26.27,36.1 arc45 26.36,36.33 26.36,43.81 27.7,45.15 arc-45 27.92,45.24 30.01,45.24 31.15,46.38 arc-45 31.37,46.47 GPIO_OUT1.10_UART_RXD
  Bottom 0.254: GPIO_OUT1.10_UART_RXD 32.71,47.62 33.66,49.53 43.51,49.53 44.78,47.7 46.05,47.7 GPIO_OUT2.10_UART_RXD 48.9,47.31 49.86,48.26 50.49,49.85 52.08,52.39 61.92,54.29 D21.A 68.91,56.99 76.53,58.18 78.11,58.18 79.62,56.75 80.97,50.48 82.88,48.58 83.12,47.78 84.62,47.7 GPIO_IN.10_UART_RXD
UART_TXD
  Top 0.254: GPIO_IN.8_UART_TXD 84.54,47.7 83.35,47.7 58.11,47.62 D20.A | UART1.TXD 13.25,38.64 arc-45 13.48,38.73 24.14,38.73 25.32,39.91 arc45 25.41,40.14 25.41,49.21 26.35,50.15 arc-45 26.57,50.24 30.17,50.24 31.38,49.03 arc45 GPIO_OUT1.8_UART_TXD
  Bottom 0.254: GPIO_OUT1.8_UART_TXD 33.35,50.8 44.14,50.8 44.78,50.24 46.05,50.24 GPIO_OUT2.8_UART_TXD 49.22,50.16 51.13,53.66 54.3,54.29 D20.A

### Text on the board
tPlace: Rev 1.0
tNames: GPIO Protect, Split & Console / (c) 2015, Unplugged Software | 3.3VDC / Zener / Diode / Array
_tPlace: GPIO_OUT1 | GPIO_OUT2 | GPIO_IN | UART1
_tNames: F2 | IC1 | Q1 | R2 | R1 | CONSOLE1 | CONSOLE1
_tDocu: CONSOLE1